# EAGLE schematic offical board (EAGLE 6.5.0)
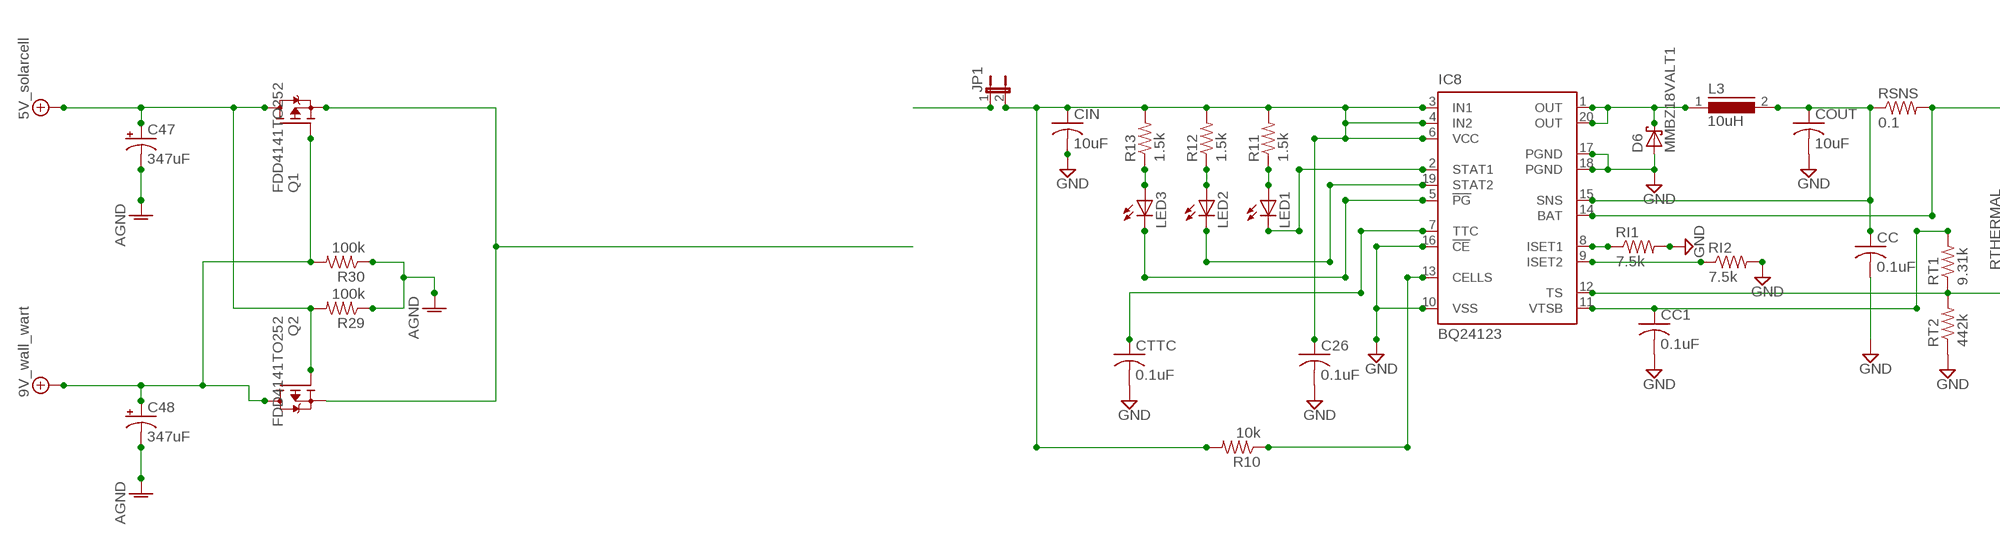
[diagram p0: schematic, sheet 1, part 1 of 2]
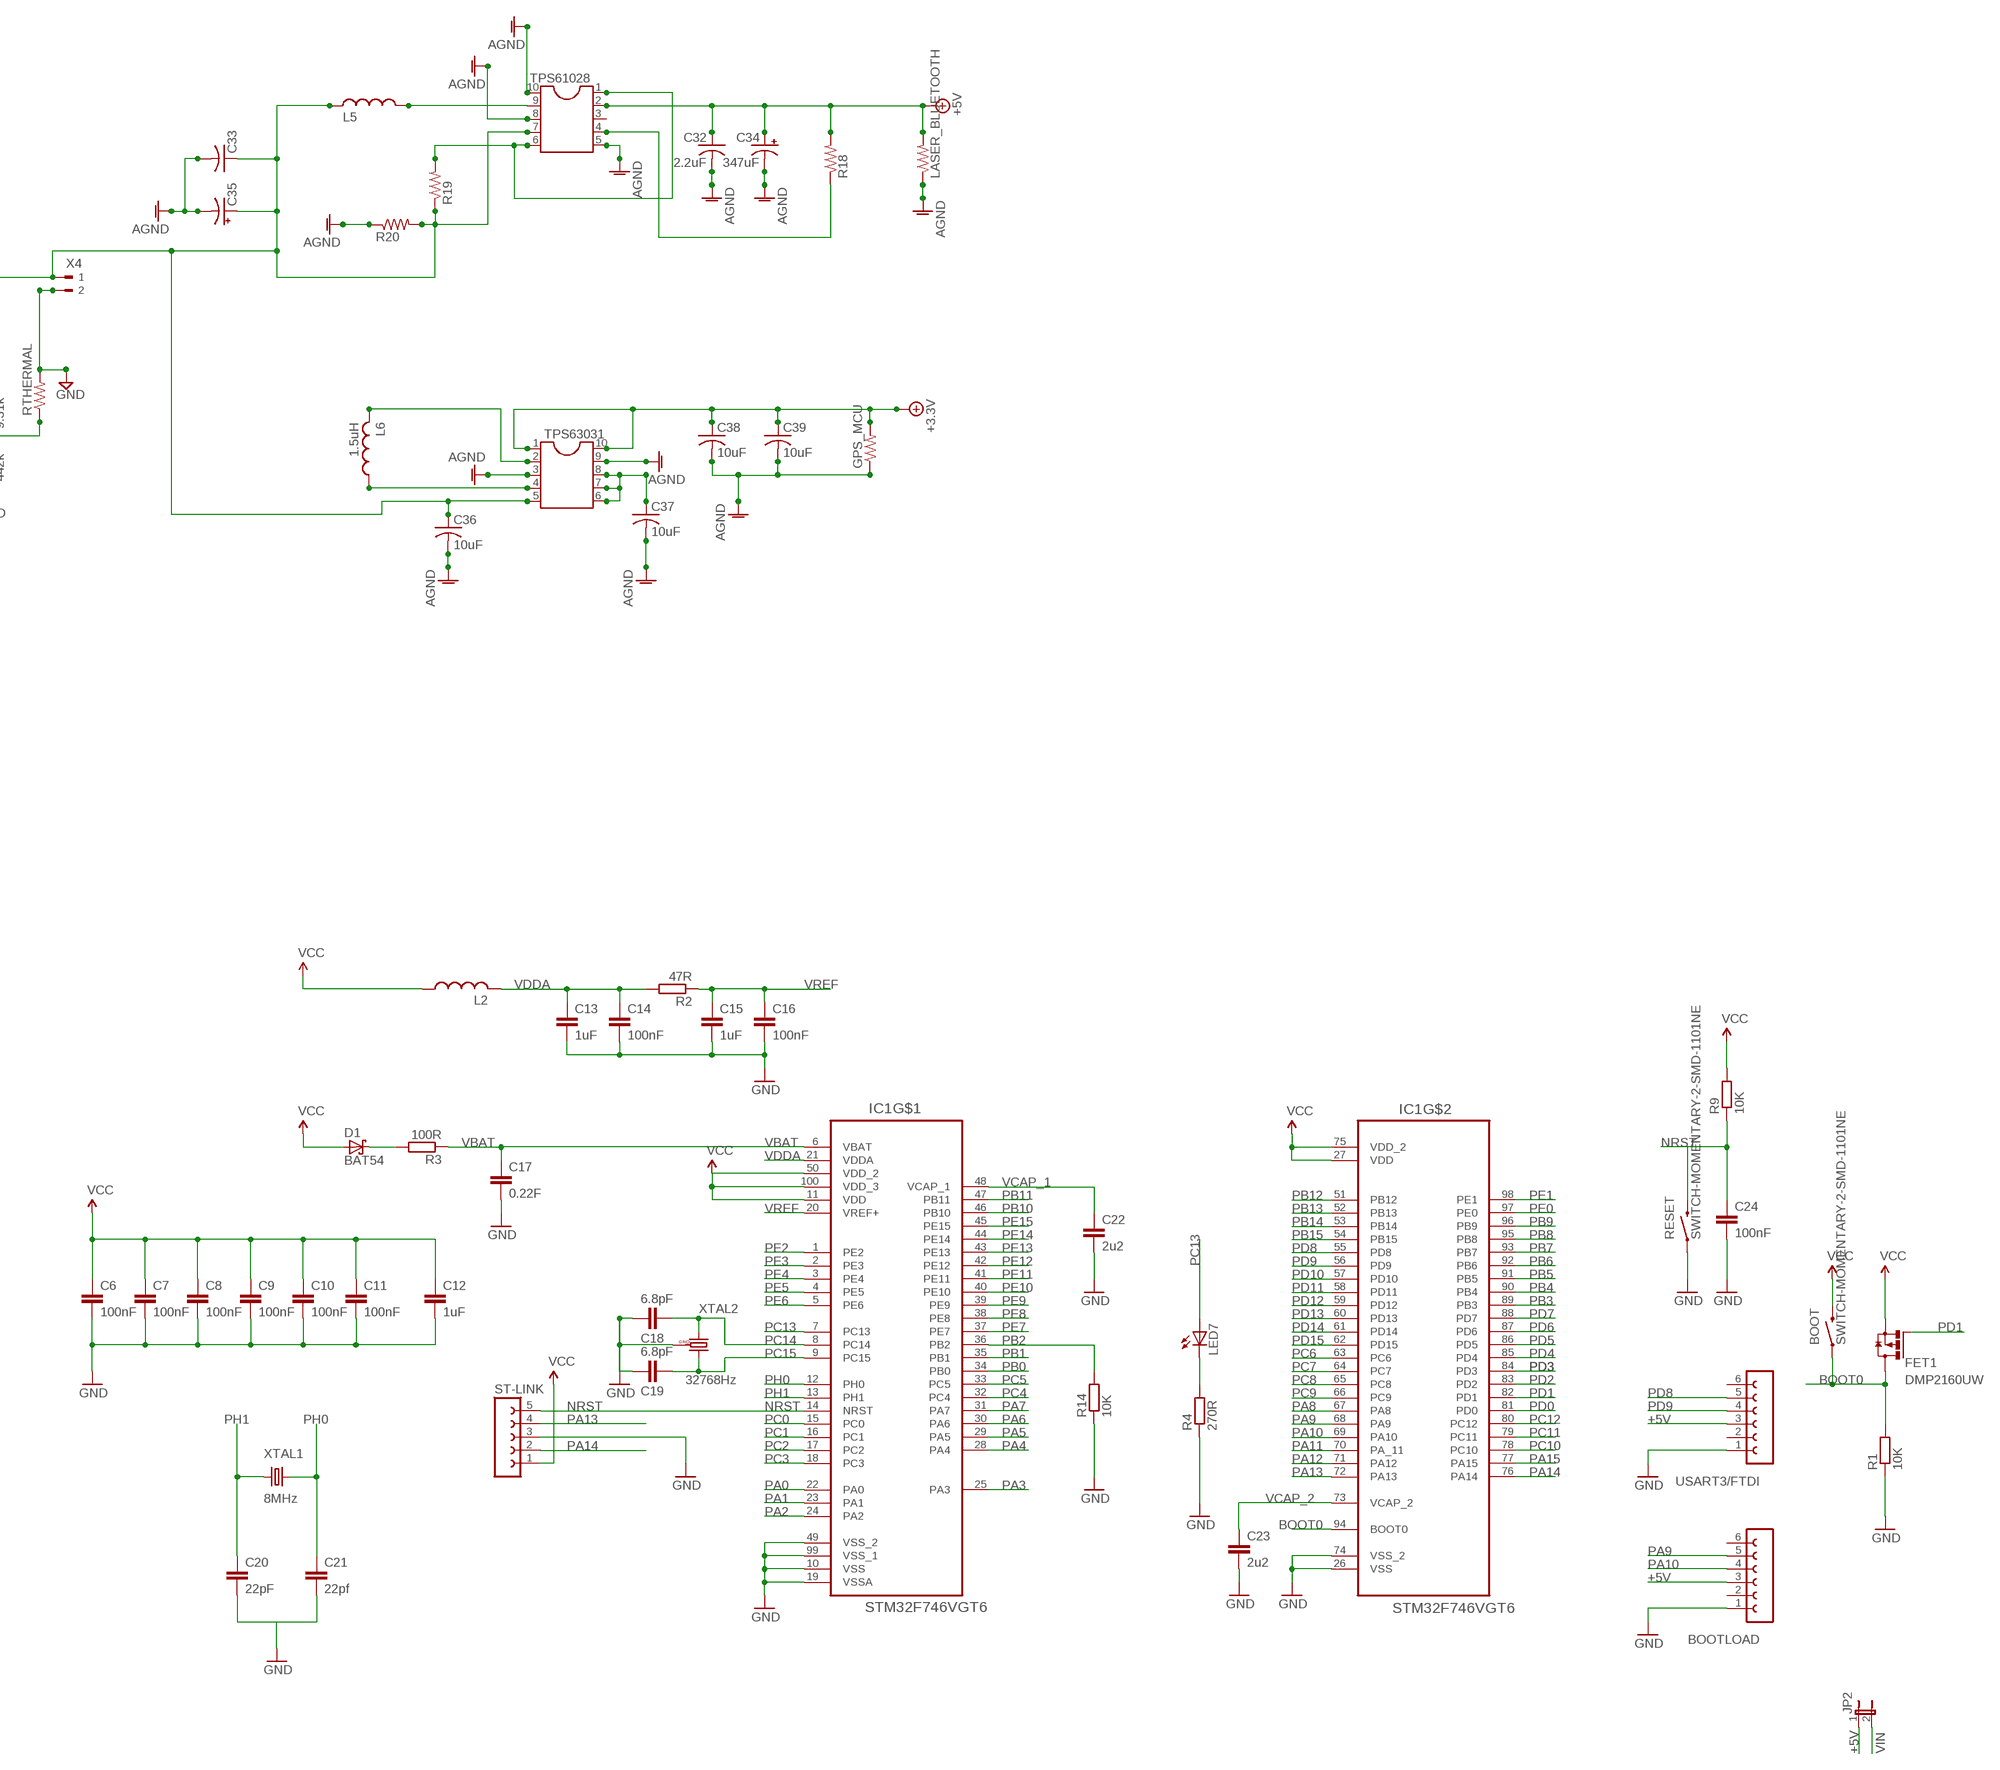
[diagram p1: schematic, sheet 1, part 2 of 2]

## Parts
BOOT  SWITCH-MOMENTARY-2-SMD-1101NE  [TACTILE-SWITCH-1101NE]
BOOTLOAD  FE06-1  [FE06]
C6  100nF  C-EUC0603  [C0603]
C7  100nF  C-EUC0603  [C0603]
C8  100nF  C-EUC0603  [C0603]
C9  100nF  C-EUC0603  [C0603]
C10  100nF  C-EUC0603  [C0603]
C11  100nF  C-EUC0603  [C0603]
C12  1uF  C-EUC0603  [C0603]
C13  1uF  C-EUC0603  [C0603]
C14  100nF  C-EUC0603  [C0603]
C15  1uF  C-EUC0603  [C0603]
C16  100nF  C-EUC0603  [C0603]
C17  0.22F  C5/5  [C5B5]
C18  6.8pF  C-EUC0603  [C0603]
C19  6.8pF  C-EUC0603  [C0603]
C20  22pF  C-EUC0603  [C0603]
C21  22pf  C-EUC0603  [C0603]
C22  2u2  C-EUC0603  [C0603]
C23  2u2  C-EUC0603  [C0603]
C24  100nF  C-EUC0603  [C0603]
C26  0.1uF  C-USC0805  [C0805]
C32  2.2uF  C-USC0603  [C0603]
C33  C-USC0603  [C0603]
C34  347uF  CPOL-US150CLZ-0810  [150CLZ-0810]
C35  CPOL-US150CLZ-0810  [150CLZ-0810]
C36  10uF  C-USC0603  [C0603]
C37  10uF  C-USC0603  [C0603]
C38  10uF  C-USC0603  [C0603]
C39  10uF  C-USC0603  [C0603]
C47  347uF  CPOL-US150CLZ-0810  [150CLZ-0810]
C48  347uF  CPOL-US150CLZ-0810  [150CLZ-0810]
CC  0.1uF  C-USC0805  [C0805]
CC1  0.1uF  C-USC0805  [C0805]
CIN  10uF  C-USC0805  [C0805]
COUT  10uF  C-USC0805  [C0805]
CTTC  0.1uF  C-USC0805  [C0805]
D1  BAT54  [SOT23]
D6  MMBZ18VALT1  1N5908  [C4111-15]
FET1  DMP2160UW  FDN360P  [SUPER-SOT3]
GPS_MCU  R-US_R0603  [R0603]
IC1  STM32F746VGT6  [QFP50P1600X1600X160-100N]
IC8  BQ24123  [QFN20_3,5X4,5]
JP1  JP1E  [JP1]
JP2  JP1E  [JP1]
L2  RCL_L-USL0603  [RCL_L0603]
L3  10uH  DR73  [DR73]
L5  L-USL2825P  [L2825P]
L6  1.5uH  L-USL2825P  [L2825P]
LASER_BLUETOOTH  R-US_R0603  [R0603]
LED1  SFH482  [SFH482]
LED2  SFH482  [SFH482]
LED3  SFH482  [SFH482]
LED7  LEDCHIP-LED0603  [CHIP-LED0603]
Q1  FDD4141TO252  [TO252]
Q2  FDD4141TO252  [TO252]
R1  10K  R-EU_R0603  [R0603]
R2  47R  R-EU_R0603  [R0603]
R3  100R  R-EU_R0603  [R0603]
R4  270R  R-EU_R0603  [R0603]
R9  10K  R-EU_R0603  [R0603]
R10  10k  R-US_R0805  [R0805]
R11  1.5k  R-US_R0805  [R0805]
R12  1.5k  R-US_R0805  [R0805]
R13  1.5k  R-US_R0805  [R0805]
R14  10K  R-EU_R0603  [R0603]
R18  R-US_R0603  [R0603]
R19  R-US_R0603  [R0603]
R20  R-US_R0603  [R0603]
R29  100k  R-US_R0603  [R0603]
R30  100k  R-US_R0603  [R0603]
RESET  SWITCH-MOMENTARY-2-SMD-1101NE  [TACTILE-SWITCH-1101NE]
RI1  7.5k  R-US_R0805  [R0805]
RI2  7.5k  R-US_R0805  [R0805]
RSNS  0.1  R-US_R1206  [R1206]
RT1  9.31k  R-US_R0805  [R0805]
RT2  442k  R-US_R0805  [R0805]
RTHERMAL  R-US_R0805  [R0805]
ST-LINK  FE05-1  [FE05-1]
TPS61028  DIL10  [DIL10]
TPS63031  DIL10  [DIL10]
USART3/FTDI  FE06-1  [FE06]
X4  90-2  [90-2]
XTAL1  8MHz  CRYSTALHC49U-V  [HC49U-V]
XTAL2  32768Hz  CRYSTAL_Q_GNDS  [CRYSTAL_TC26H_3_REPAIR_SMD_SMALL_PITCH]

## Nets
+5V [power usb]: BOOTLOAD.3 C32.1 C34.+ C38.1 C39.1 C47.+ C48.+ GPS_MCU.2 JP2.1 LASER_BLUETOOTH.2 Q1.1(G) Q1.3(D) Q2.1(G) Q2.3(D) R18.2 R29.2 R30.2 TPS61028.2 TPS63031.1 TPS63031.10 USART3/FTDI.3 ; supply symbol labelled +3.3V, 5V_solarcell, 9V_wall_wart
AGND: C32.2 C33.2 C34.- C35.- C36.2 C37.2 C38.2 C39.2 C47.- C48.- GPS_MCU.1 LASER_BLUETOOTH.1 R20.1 R29.1 R30.1 TPS61028.5 TPS61028.8 TPS61028.10 TPS63031.3 TPS63031.9
BOOT0: BOOT.P$1 FET1.3(D) IC1.94(BOOT0) R1.2
GND [thin_power]: BOOTLOAD.1 C6.2 C7.2 C8.2 C9.2 C10.2 C11.2 C12.2 C13.2 C14.2 C15.2 C16.2 C17.2 C18.2 C19.2 C20.2 C21.2 C22.2 C23.2 C24.2 C26.2 CC1.2 CC.2 CIN.2 COUT.2 CTTC.2 D6.A IC1.10(VSS) IC1.19(VSSA) IC1.26(VSS) IC1.49(VSS_2) IC1.74(VSS_2) IC1.99(VSS_1) IC8.10(VSS) IC8.16(!CE) IC8.17(PGND) IC8.18(PGND) R1.1 R4.1 R14.1 RESET.P$1 RI1.2 RI2.2 RT2.1 RTHERMAL.2 ST-LINK.3 USART3/FTDI.1 X4.2 XTAL2.GND
N$4 [power usb]: Q1.2(S) Q2.2(S)
N$6: D6.C IC8.1(OUT) IC8.20(OUT) L3.1
N$8 [power usb]: JP1.1
N$12: CC.1 COUT.1 IC8.15(SNS) L3.2 RSNS.1
N$18: IC8.8(ISET1) RI1.1
N$21: IC8.9(ISET2) RI2.1
N$22: IC8.12(TS) RT1.1 RT2.2 RTHERMAL.1
N$23: CC1.1 IC8.11(VTSB) RT1.2
N$24: LED3.A R13.1
N$25: LED2.A R12.1
N$26: LED1.A R11.1
N$27: IC8.2(STAT1) LED1.K(C)
N$28: IC8.19(STAT2) LED2.K(C)
N$29: IC8.5(!PG) LED3.K(C)
N$30: CTTC.1 IC8.7(TTC)
N$31: IC8.13(CELLS) R10.1
N$37: C26.1 CIN.1 IC8.3(IN1) IC8.4(IN2) IC8.6(VCC) JP1.2 R10.2 R11.2 R12.2 R13.2
N$39: D1.3(C) R3.2
N$44: R18.1 TPS61028.4
N$45: R19.2 TPS61028.1 TPS61028.6
N$47: L5.1 TPS61028.9
N$48: C33.1 C35.+ C36.1 IC8.14(BAT) L5.2 R19.1 R20.2 RSNS.2 TPS61028.7 TPS63031.5 X4.1
N$49: L6.2 TPS63031.2
N$50: L6.1 TPS63031.4
N$51: C37.1 TPS63031.6 TPS63031.7 TPS63031.8
N$57: LED7.C R4.2
NRST: C24.1 IC1.14(NRST) R9.1 RESET.P$2 ST-LINK.5
PA0: IC1.22(PA0)
PA1: IC1.23(PA1)
PA2: IC1.24(PA2)
PA3: IC1.25(PA3)
PA4: IC1.28(PA4)
PA5: IC1.29(PA5)
PA6: IC1.30(PA6)
PA7: IC1.31(PA7)
PA8: IC1.67(PA8)
PA9: BOOTLOAD.5 IC1.68(PA9)
PA10: BOOTLOAD.4 IC1.69(PA10)
PA11: IC1.70(PA_11)
PA12: IC1.71(PA12)
PA13: IC1.72(PA13) ST-LINK.4
PA14: IC1.76(PA14) ST-LINK.2
PA15: IC1.77(PA15)
PB0: IC1.34(PB0)
PB1: IC1.35(PB1)
PB2: IC1.36(PB2) R14.2
PB3: IC1.89(PB3)
PB4: IC1.90(PB4)
PB5: IC1.91(PB5)
PB6: IC1.92(PB6)
PB7: IC1.93(PB7)
PB8: IC1.95(PB8)
PB9: IC1.96(PB9)
PB10: IC1.46(PB10)
PB11: IC1.47(PB11)
PB12: IC1.51(PB12)
PB13: IC1.52(PB13)
PB14: IC1.53(PB14)
PB15: IC1.54(PB15)
PC0: IC1.15(PC0)
PC1: IC1.16(PC1)
PC2: IC1.17(PC2)
PC3: IC1.18(PC3)
PC4: IC1.32(PC4)
PC5: IC1.33(PC5)
PC6: IC1.63(PC6)
PC7: IC1.64(PC7)
PC8: IC1.65(PC8)
PC9: IC1.66(PC9)
PC10: IC1.78(PC10)
PC11: IC1.79(PC11)
PC12: IC1.80(PC12)
PC13: IC1.7(PC13) LED7.A
PC14: C18.1 IC1.8(PC14) XTAL2.1
PC15: C19.1 IC1.9(PC15) XTAL2.2
PD0: IC1.81(PD0)
PD1: FET1.1(G) IC1.82(PD1)
PD2: IC1.83(PD2)
PD3: IC1.84(PD3)
PD4: IC1.85(PD4)
PD5: IC1.86(PD5)
PD6: IC1.87(PD6)
PD7: IC1.88(PD7)
PD8: IC1.55(PD8) USART3/FTDI.5
PD9: IC1.56(PD9) USART3/FTDI.4
PD10: IC1.57(PD10)
PD11: IC1.58(PD11)
PD12: IC1.59(PD12)
PD13: IC1.60(PD13)
PD14: IC1.61(PD14)
PD15: IC1.62(PD15)
PE0: IC1.97(PE0)
PE1: IC1.98(PE1)
PE2: IC1.1(PE2)
PE3: IC1.2(PE3)
PE4: IC1.3(PE4)
PE5: IC1.4(PE5)
PE6: IC1.5(PE6)
PE7: IC1.37(PE7)
PE8: IC1.38(PE8)
PE9: IC1.39(PE9)
PE10: IC1.40(PE10)
PE11: IC1.41(PE11)
PE12: IC1.42(PE12)
PE13: IC1.43(PE13)
PE14: IC1.44(PE14)
PE15: IC1.45(PE15)
PH0: C21.1 IC1.12(PH0) XTAL1.2
PH1: C20.1 IC1.13(PH1) XTAL1.1
VBAT: C17.1 IC1.6(VBAT) R3.1
VCAP_1: C22.1 IC1.48(VCAP_1)
VCAP_2: C23.1 IC1.73(VCAP_2)
VCC [thin_power]: BOOT.P$2 C6.1 C7.1 C8.1 C9.1 C10.1 C11.1 C12.1 D1.1(A) FET1.2(S) IC1.11(VDD) IC1.27(VDD) IC1.50(VDD_2) IC1.75(VDD_2) IC1.100(VDD_3) L2.1 R9.2 ST-LINK.1
VDDA: C13.1 C14.1 IC1.21(VDDA) L2.2 R2.2
VIN: JP2.2
VREF: C15.1 C16.1 IC1.20(VREF+) R2.1
Unconnected: BOOTLOAD.2 BOOTLOAD.6 IC8.EXP IC8.EXP@1 IC8.EXP@2 IC8.EXP@3 IC8.EXP@4 IC8.EXP@5 IC8.EXP@6 IC8.EXP@7 IC8.EXP@8 IC8.EXP@9 IC8.EXP@10 IC8.EXP@11 IC8.EXP@12 TPS61028.3 USART3/FTDI.2 USART3/FTDI.6

## Library data of the parts
BOOT RESET = SparkFun-Electromechanical:SWITCH-MOMENTARY-2: Various NO switches- pushbuttons, reed, etc
BOOTLOAD USART3/FTDI = con-lsta:FE06-1: FEMALE HEADER; OC_FARNELL: unknown; OC_NEWARK: unknown
C6-C16 C18-C24 = rcl:C-EU: CAPACITOR, European symbol
C17 = capacitor-wima:C: CAPACITOR naming: grid - package width
C26 C32 C33 C36-C39 CC CC1 CIN COUT CTTC = resistor:C-US: CAPACITOR, American symbol
C34 C35 C47 C48 = resistor:CPOL-US: POLARIZED CAPACITOR, American symbol
D1 = diode:BAT54: Schottky Diodes Source: Fairchild .. BAT54.pdf
D6 = diode:1N5908: DIODE schottky
FET1 = transistor-power:FDN360P: Single P-Channel, PowerTrench (R) MOSFET Source: http://www.fairchildsemi.com/ds/FD/FDN360P.pdf
GPS_MCU LASER_BLUETOOTH R10-R13 R18-R20 R29 R30 RI1 RI2 RSNS RT1 RT2 RTHERMAL = resistor:R-US_: RESISTOR, American symbol
IC1 = STM32F7x:STM32F746VGT6
IC8 = texas:BQ24123: SINGLE-CHIP SWITCHMODE, LI-ION AND LI-POLYMER CHARGE-MANAGEMENT IC WITH ENHANCED EMI PERFORMANCE(bqSWITCHER) Source: www.ti.com .. TI-bq24125.pdf; MPN: BQ24123RHLT; OC_FARNELL: 1407131; OC_NEWARK: 84K0851
JP1 JP2 = jumper:JP1E: JUMPER
L2 = STM32F407_Rev_1:RCL_L-US: INDUCTOR, American symbol
L3 = inductors:DR73: High Power Density, High Efficiency, Shielded Inductors Source: coiltronics_dr_series.pdf
L5 L6 = resistor:L-US: INDUCTOR, American symbol
LED1-LED3 = led:SFH482: IR LED infrared emitting diode, Infineon
LED7 = ledIR:LED: LED OSRAM: - CHIPLED LG R971, LG N971, LY N971, LG Q971, LY Q971, LO R971, LY R971 LH N974, LH R974 LS Q976, LO Q976, LY Q976 LO Q996 - Hyper CHIPLED LW Q18S LB Q993, LB Q99A, LB R99A - SideLED LS A670, LO A670, LY A670, LG A670, LP A670 LB A673, LV A673, LT A673, LW A673 LH A674 LY A675 LS A676, LA A676, LO A676, LY A676, LW A676 LS A679, LY A679, LG A679 - Hyper Micro SIDELED® LS Y876, LA Y876, LO Y876, LY Y876 LT Y87S - SmartLED LW L88C, LW L88S LB L89C, LB L89S, LG L890 LS L89K, LO L89K, LY L89K LS L896, LA L896, LO L896, LY L896 - TOPLED LS T670, LO T670, LY T670, LG T670, LP T670 LSG T670, LSP T670, LSY T670, LOP T670, LYG T670 LG T671, LOG T671, LSG T671 LB T673, LV T673, LT T673, LW T673 LH T674 LS T676, LA T676, LO T676, LY T676, LB T676, LH T676, LSB T676, LW T676 LB T67C, LV T67C, LT T67C, LS T67K, LO T67K, LY T67K, LW E67C LS E67B, LA E67B, LO E67B, LY E67B, LB E67C, LV E67C, LT E67C LW T67C LS T679, LY T679, LG T679 LS T770, LO T770, LY T770, LG T770, LP T770 LB T773, LV T773, LT T773, LW T773 LH T774 LS E675, LA E675, LY E675, LS T675 LS T776, LA T776, LO T776, LY T776, LB T776 LHGB T686 LT T68C, LB T68C - Hyper Mini TOPLED® LB M676 - Mini TOPLED Santana® LG M470 LS M47K, LO M47K, LY M47K Source: http://www.osram.convergy.de LUXEON: - LUMILED® LXK2-PW12-R00, LXK2-PW12-S00, LXK2-PW14-U00, LXK2-PW14-V00 LXK2-PM12-R00, LXK2-PM12-S00, LXK2-PM14-U00 LXK2-PE12-Q00, LXK2-PE12-R00, LXK2-PE12-S00, LXK2-PE14-T00, LXK2-PE14-U00 LXK2-PB12-K00, LXK2-PB12-L00, LXK2-PB12-M00, LXK2-PB14-N00, LXK2-PB14-P00, LXK2-PB14-Q00 LXK2-PR12-L00, LXK2-PR12-M00, LXK2-PR14-Q00, LXK2-PR14-R00 LXK2-PD12-Q00, LXK2-PD12-R00, LXK2-PD12-S00 LXK2-PH12-R00, LXK2-PH12-S00 LXK2-PL12-P00, LXK2-PL12-Q00, LXK2-PL12-R00 Source: www.luxeon.com KINGBRIGHT: KA-3528ASYC Source: www.kingbright.com
Q1 Q2 = transistor-fet:FDD4141: P-Channel PowerTrench® MOSFET Source: FDD4141.pdf
R1 R2 R9 R14 = rcl:R-EU_: RESISTOR, European symbol
R3 R4 = resistor:R-EU_: RESISTOR, European symbol
ST-LINK = con-lsta:FE05-1: FEMALE HEADER; OC_FARNELL: unknown; OC_NEWARK: unknown
TPS61028 TPS63031 = ic-package:DIL10: Dual In Line / Socket
X4 = con-weidmueller-sl35:90-2: WEIDMUELLER CLAMP CONNECTOR; OC_FARNELL: unknown; OC_NEWARK: unknown
XTAL1 = crystal:CRYSTAL: CRYSTAL; OC_FARNELL: 1666969; OC_NEWARK: unknown
XTAL2 = STM32F407_Rev_1:CRYSTAL_Q_GND

## Net classes
2 thin_power: width 0.254 mm
3 power usb: width 0.508 mm, drill 0.406 mm, clearance 0.203 mm